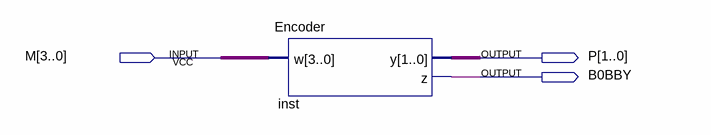
[diagram p0: schematic sheet]
// Quartus schematic lab4_encoder.bdf as structural Verilog: 1 symbols, 3 pins
module lab4_encoder (
  input  [3:0] M,
  output [1:0] P,
  output B0BBY
);

  Encoder inst (.w(M), .y(P), .z(B0BBY));
endmodule
